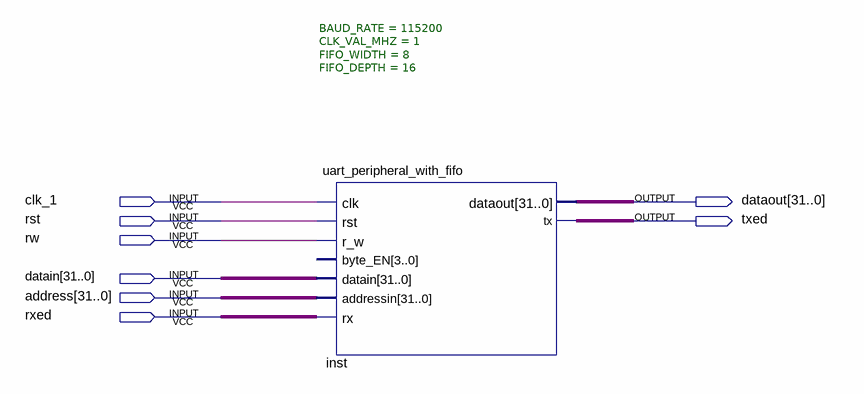
[diagram p0: schematic sheet]
// Quartus schematic uart_fifo_test.bdf as structural Verilog: 1 symbols, 8 pins
module uart_fifo_test (
  input  clk_1,
  input  rst,
  input  rw,
  input  [31:0] datain,
  input  [31:0] address,
  input  rxed,
  output [31:0] dataout,
  output txed
);

  uart_peripheral_with_fifo #(.BAUD_RATE(115200), .CLK_VAL_MHZ(1), .FIFO_WIDTH(8), .FIFO_DEPTH(16)) inst (
    .clk(clk_1), .rst(rst), .r_w(rw), .datain(datain), .addressin(address), .rx(rxed), .dataout(dataout),
    .tx(txed));  // open: byte_EN
endmodule
